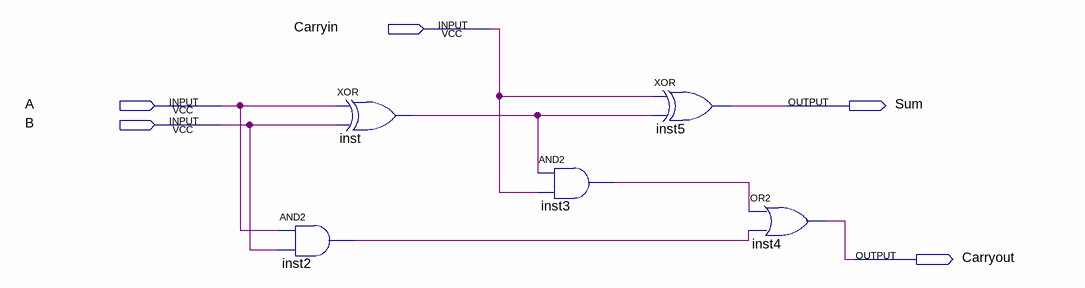
[diagram p0: schematic sheet]
// Quartus schematic FULL_ADDER_1bit.bdf as structural Verilog: 5 symbols, 5 pins
module FULL_ADDER_1bit (
  input  Carryin,
  input  A,
  input  B,
  output Sum,
  output Carryout
);

  wire inst2_out, inst3_out, inst_out;

  and inst2 (inst2_out, A, B);
  xor inst (inst_out, A, B);
  and inst3 (inst3_out, inst_out, Carryin);
  xor inst5 (Sum, Carryin, inst_out);
  or inst4 (Carryout, inst3_out, inst2_out);
endmodule
